# Altium schematic sheet nm_npu_proc.SchDoc
size 209 x 297 mm; SheetNumber: 8; SheetTotal: 9
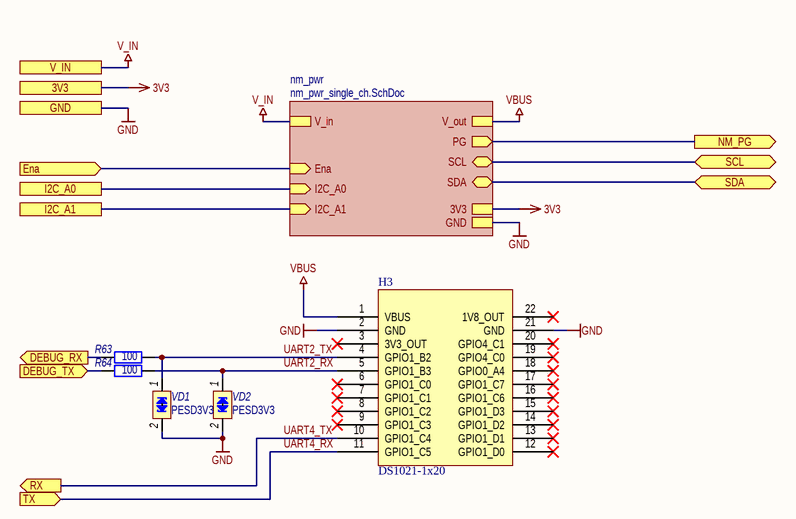
[diagram p0: nm_npu_proc.SchDoc]

## Parts
H3  DS1021-1x20  [DS1021-1x20]
R63  value 100  [SMD_0603]  (hidden comment: Resistor)
R64  value 100  [SMD_0603]  (hidden comment: Resistor)
VD1  PESD3V3  [SOD-323]
VD2  PESD3V3  [SOD-323]

## Sub-sheets
nm_pwr = nm_pwr_single_ch.SchDoc: Ena (in), V_in, PG (out), GND, SCL (bidir), SDA (bidir), I2C_A0 (in), I2C_A1 (in), 3V3, V_out  | TP_STR: 5V0; R1_Value: 160k; R2_Value: 30k; R_efuse1_mid: 120k; R_efuse1_bot: 43k; R_efuse1_ilim: 3k3; R_pwr_led: 4k7; R_efuse2_bot: 130k; R_efuse2_mid: 62k; R_efuse2_ilim: 3k3; R_efuse1_top: 470k; R_efuse2_top: 470k; C_efuse2_dVdT: 10нФ; C_efuse2_itimer: 2.4нФ

## Ports
3V3, DEBUG_RX (out), DEBUG_TX (in), Ena (in), GND, I2C_A0, I2C_A1, NM_PG (out), RX (out), SCL (bidir), SDA (bidir), TX (in), V_IN

## Nets
3V3: port 3V3, sheet nm_pwr/3V3
GND: H3.2(GND) H3.21(GND) VD1.2(cathode_2) VD2.2(cathode_2) ; port GND, sheet nm_pwr/GND
V_IN: port V_IN, sheet nm_pwr/V_in
VBUS: H3.1(VBUS) ; sheet nm_pwr/V_out
DEBUG_RX: R63.1 ; port DEBUG_RX
DEBUG_TX: R64.1 ; port DEBUG_TX
Ena: port Ena, sheet nm_pwr/Ena
I2C_A0: port I2C_A0, sheet nm_pwr/I2C_A0
I2C_A1: port I2C_A1, sheet nm_pwr/I2C_A1
NM_PG: port NM_PG, sheet nm_pwr/PG
SCL: port SCL, sheet nm_pwr/SCL
SDA: port SDA, sheet nm_pwr/SDA
UART2_RX: H3.5(GPIO1_B3) R64.2 VD2.1(cathode_1)
UART2_TX: H3.4(GPIO1_B2) R63.2 VD1.1(cathode_1)
UART4_RX: H3.11(GPIO1_C5) ; port TX
UART4_TX: H3.10(GPIO1_C4) ; port RX

Not connected (* = marked no-connect by the designer): H3 3(3V3_OUT)* 6(GPIO1_C0)* 7(GPIO1_C1)* 8(GPIO1_C2)* 9(GPIO1_C3)* 12(GPIO1_D0)* 13(GPIO1_D1)* 14(GPIO1_D2)* 15(GPIO1_D3)* 16(GPIO1_C6)* 17(GPIO1_C7)* 18(GPIO0_A4)* 19(GPIO4_C0)* 20(GPIO4_C1)* 22(1V8_OUT)*

## Notes on the sheet
- Подп. и дата
- Инв. № дубл.
- Взам. инв. №
- Инв. № подл.
- Изм.
- Лист
- № докум.
- Подп.
- Дата
- Форма 2а ГОСТ 2.104-2006
- Копировал
- Формат А4

## Library data of the parts
R63 R64 = Resistor: Наименование: Резистор; Назначение: SMD-резистор; Потребление, Вт: 0,001; Точность: %; Place_v1: *; Place_v2: *
VD1 VD2 = PESDxL1BA: Low capacitance bidirectional ESD protection diodes; Назначение: ESD защитные диоды; Потребление, Вт: 0.0; Наименование: PESDxL1BA; ComponentLink1Description: DataSheet; ComponentLink1URL: https://static.chipdip.ru/lib/635/DOC005635911.pdf